# EasyEDA Pro project CH32V003 Programmer.eprj

# Schematic Schematic1
Board Name: Board1; Create Date: 2025-06-25; Page Name: P1; Project Name: CH32V003 Programmer; Schematic Name: Schematic1; Update Date: 2025-08-17; Company: m039; Drawn: Dmitry Mozgin; Page Size: A4; Version: V1.0
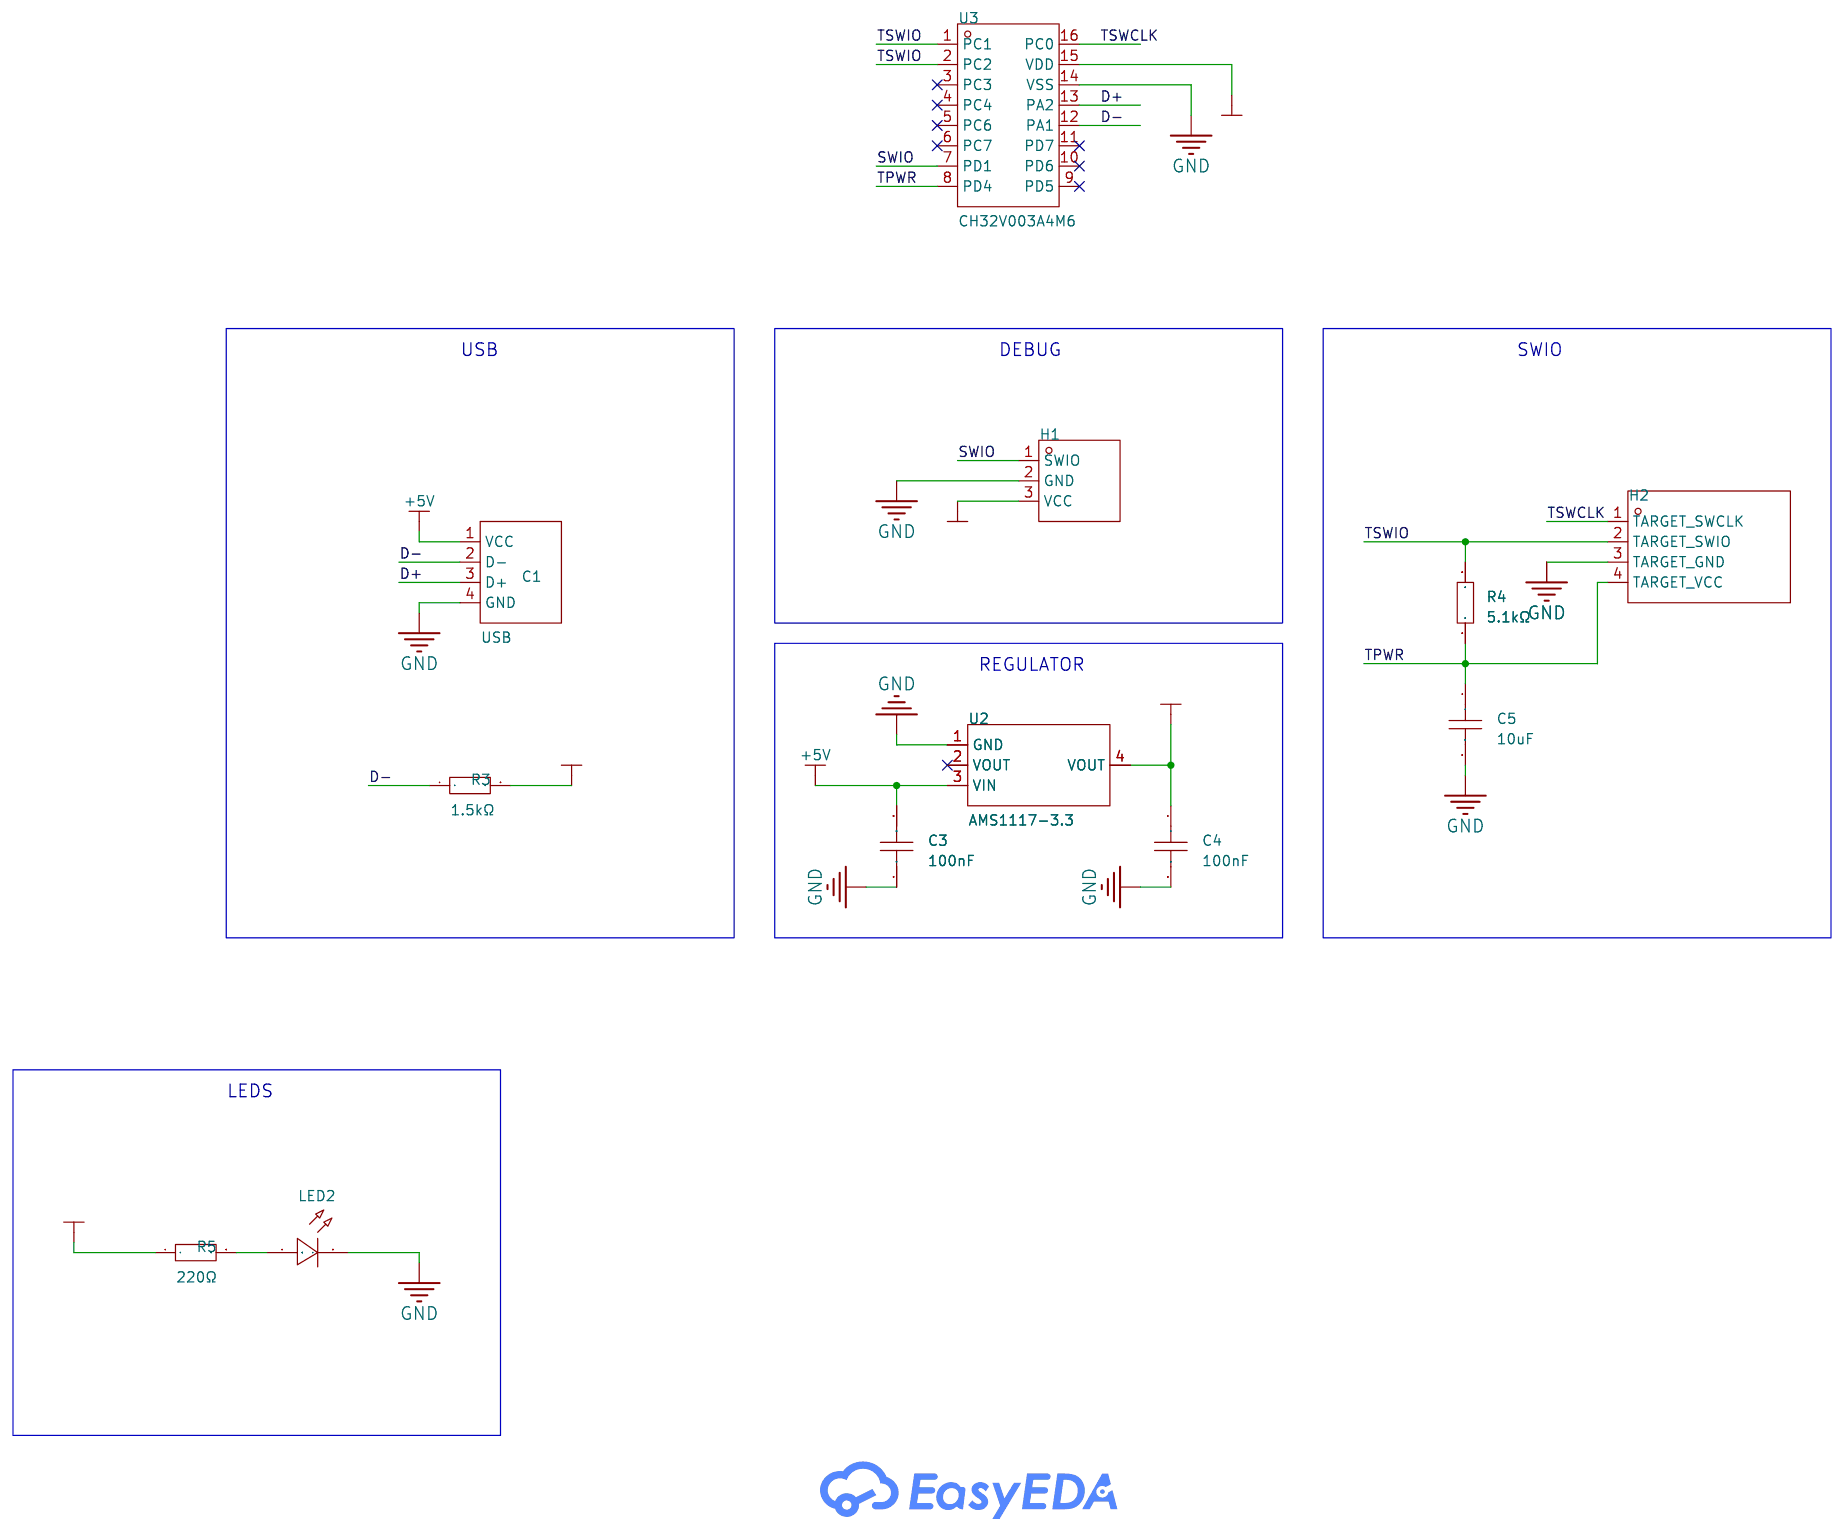
[diagram p0: schematic sheet]

## Parts
C1  USB  [USB Type-C 4P]
C3  100nF  [CAP-TH_L5.8-W3.0-P4.7-D0.45]
C4  100nF  [CAP-TH_L5.8-W3.0-P4.7-D0.45]
C5  10uF  [CAP-TH_L5.8-W3.0-P4.7-D0.45]
H1  -  [HDR-TH_3P-P2.54-V-M]
H2  -  [HDR-TH_4P-P2.54-V-M]
LED2  -  [LED-TH_BD3.0-P2.54-FD]
R3  1.5kΩ  [RES-TH_BD1.8-L3.2-P7.20-D0.4]
R4  5.1kΩ  [RES-TH_BD1.8-L3.2-P7.20-D0.4]
R5  220Ω  [RES-TH_BD1.8-L3.2-P7.20-D0.4]
U2  AMS1117-3.3  [SOT-223-3_L6.5-W3.4-P2.30-LS7.0-BR]
U3  CH32V003A4M6  [SOIC-16_L9.9-W3.9-P1.27-LS6.0-BL]

## Library data of the parts
C1 = USB Type-C 4P Board
C3-C5 = 1C10Z5U104M050B: LCSC Part Name: 100nF ±20% 50V; Supplier Part: C3009699; Manufacturer: VISHAY(威世); Supplier Footprint: 插件,P=10mm; JLCPCB Part Class: Extended Part; Datasheet: https://atta.szlcsc.com/upload/public/pdf/source/20210701/0CF1A7AD3406E72B391D35880AF61B15.pdf; Supplier: LCSC; Tolerance: ±20%; Voltage Rating: 50V; Pin Spacing: 2.54mm; Temperature Coefficient: Z5U; Diameter: 5.08mm; Body Thickness: 3.18mm
H1 = HDR-M_2.54_1x3P: Supplier Footprint: Through
H2 = HDR-M_2.54_1x4P: Supplier Footprint: Through
LED2 = LED_TH-R_3mm: Supplier Footprint: Through
R3-R5 = Res_AXIAL-1/8W: Supplier Footprint: Through
U2 = AMS1117-3.3_C6186: LCSC Part Name: 输出3.3V 1A; Supplier Part: C6186; Manufacturer: AMS; Supplier Footprint: SOT-223; JLCPCB Part Class: Basic Part; Datasheet: https://atta.szlcsc.com/upload/public/pdf/source/20180727/C6186_7A095716F0823C02F1997A905E26C086.pdf; Supplier: LCSC; Output Type: Fixed; Voltage - Supply: 16V; Output Voltage: 3.3V; Output Current: 1A; Power Supply Rejection Ratio (PSRR): 72dB@(120Hz); Voltage Dropout: 1.1V@(800mA); standby current: 5mA; Features: Over Current Protection；Over Temperature Protection; Operating Temperature: -40℃~+125℃; Output Configuration: Positive; Number of Outputs: 1
U3 = CH32V003A4M6: Supplier Part: C5346357; Manufacturer: WCH(南京沁恒); Supplier Footprint: SOP-16; JLCPCB Part Class: Extended Part; Datasheet: https://atta.szlcsc.com/upload/public/pdf/source/20250604/86DFE64B14CD7099775DB96D45CE90A6.pdf; Supplier: LCSC

## Nets
+3.3V: C4.1 H1.3(VCC) R3.2 R5.1 U2.4(VOUT) U3.15(VDD)
+5V: C1.1(VCC) C3.2 U2.3(VIN)
GND: C1.4(GND) C3.1 C4.2 C5.2 H1.2(GND) H2.3(TARGET_GND) LED2.2(A) U2.1(GND) U3.14(VSS)
D+: C1.3(D+) U3.13(PA2)
D-: C1.2(D-) R3.1 U3.12(PA1)
SWIO: H1.1(SWIO) U3.7(PD1)
TPWR: C5.1 H2.4(TARGET_VCC) R4.1 U3.8(PD4)
TSWCLK: H2.1(TARGET_SWCLK) U3.16(PC0)
TSWIO: H2.2(TARGET_SWIO) R4.2 U3.1(PC1) U3.2(PC2)
$1N3644: LED2.1(C) R5.2

Not connected (* = marked no-connect by the designer): U2 2(VOUT)*; U3 3(PC3)* 4(PC4)* 5(PC6)* 6(PC7)* 9(PD5)* 10(PD6)* 11(PD7)*

## Notes on the sheet
- USB
- DEBUG
- SWIO
- REGULATOR
- LEDS

# Board PCB1
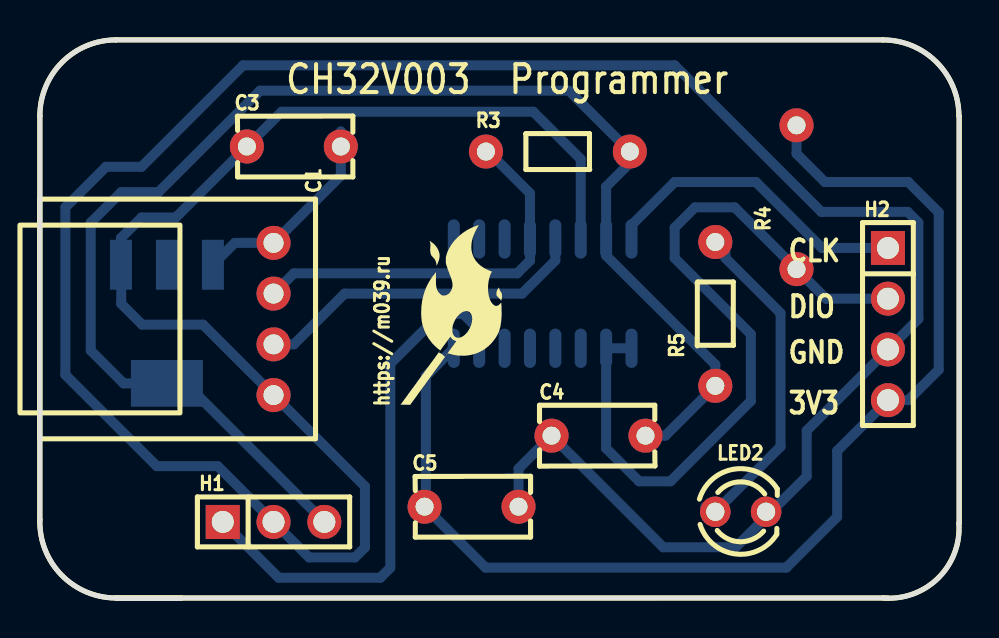
[diagram p1: board, top side]
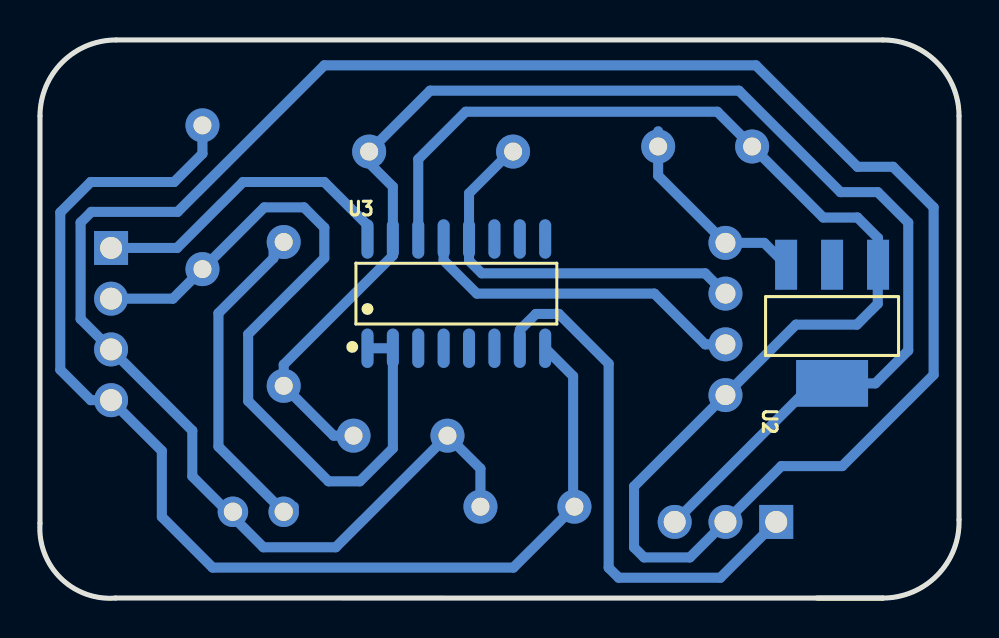
[diagram p2: board, bottom side, seen from below]

Outline 45.97 x 27.94 mm; copper layers: Top Layer, Bottom Layer. Coordinates in mm from the lower left corner of the outline.
Outline path: 3.81,0 arc(1.08,1.15) 0,3.92 0,24.13 arc(1.12,26.83) 3.81,27.94 42.16,27.94 arc(44.86,26.82) 45.97,24.13 45.97,3.74 arc(44.94,1) 42.19,0 3.81,0 ; 3.81,0 7.11,0
Stack: Top Layer 0.035mm / Dielectric1 1.51mm FR4 er 4.5 / Bottom Layer 0.035mm

## Design rules (mm)
template: Custom Config
spacing copperThickness1oz (default): track to track 0.3, other pairs 0.152 to 0.3
spacing copperThickness2oz: track to track 0.203, other pairs 0.152 to 0.3
track width copperThickness1oz (default): min 0.127, default 0.5, max 2.54
track width copperThickness2oz: min 0.203, default 0.254, max 2.54
differential pair differentialPair (default): width min 0.127, default 0.254, max 2.54; gap min 0.152, default 0.152
via viaSize (default): diameter min 0.5, default 0.61, max 10; hole min 0.3, default 0.305, max 6.3

## Placement (name value [footprint] x y rotation side)
C1  USB  [USB Type-C 4P]  11.68 13.97 270 top
C3  100nF  [CAP-TH_L5.8-W3.0-P4.7-D0.45]  12.7 22.61 0 top
C4  100nF  [CAP-TH_L5.8-W3.0-P4.7-D0.45]  27.94 8.13 180 top
C5  10uF  [CAP-TH_L5.8-W3.0-P4.7-D0.45]  21.59 4.57 0 top
H1  -  [HDR-TH_3P-P2.54-V-M]  11.68 3.81 0 top
H2  -  [HDR-TH_4P-P2.54-V-M]  42.42 13.72 270 top
LED2  -  [LED-TH_BD3.0-P2.54-FD]  35.05 4.32 0 top
R3  1.5kΩ  [RES-TH_BD1.8-L3.2-P7.20-D0.4]  25.91 22.35 0 top
R4  5.1kΩ  [RES-TH_BD1.8-L3.2-P7.20-D0.4]  37.85 20.07 270 top
R5  220Ω  [RES-TH_BD1.8-L3.2-P7.20-D0.4]  33.78 14.23 90 top
U2  AMS1117-3.3  [SOT-223-3_L6.5-W3.4-P2.30-LS7.0-BR]  6.35 13.72 90 bottom
U3  CH32V003A4M6  [SOIC-16_L9.9-W3.9-P1.27-LS6.0-BL]  25.15 15.24 180 bottom

## Footprints (pads in the part's own frame, mm; a bottom-side part is the same pattern mirrored in y, then rotated)
CAP-TH_L5.8-W3.0-P4.7-D0.45
  round 1.7 hole 0.9: 1(-2.35,0) 2(2.35,0)
HDR-TH_3P-P2.54-V-M
  rect 1.7x1.7 hole 1.1x0.9: 1(-2.54,0)
  round 1.7 hole 1.1x0.9: 2(0,0) 3(2.54,0)
HDR-TH_4P-P2.54-V-M
  rect 1.7x1.7 hole 1.1x0.9: 1(-3.81,0)
  round 1.7 hole 1.1x0.9: 2(-1.27,0) 3(1.27,0) 4(3.81,0)
LED-TH_BD3.0-P2.54-FD
  round 1.524 hole 0.914x0.9: 1(-1.27,0) 2(1.27,0)
RES-TH_BD1.8-L3.2-P7.20-D0.4
  round 1.7 hole 0.9: 1(-3.6,0) 2(3.6,0)
SOIC-16_L9.9-W3.9-P1.27-LS6.0-BL
  oval 0.602x1.971 smd: 1(-4.445,-2.736) 2(-3.175,-2.736) 3(-1.905,-2.736) 4(-0.635,-2.736) 5(0.635,-2.736) 6(1.905,-2.736) 7(3.175,-2.736) 8(4.445,-2.736) 9(4.445,2.736) 10(3.175,2.736) 11(1.905,2.736) 12(0.635,2.736) 13(-0.635,2.736) 14(-1.905,2.736) 15(-3.175,2.736) 16(-4.445,2.736)
SOT-223-3_L6.5-W3.4-P2.30-LS7.0-BR
  rect 2.5x1.1 smd: 1(2.97,-2.3) 2(2.97,0) 3(2.97,2.3)
  rect 2.34x3.6 smd: 4(-2.97,0)
USB Type-C 4P
  round 1.7 hole 1x0.9: 1(-3.81,0) 2(-1.27,0) 3(1.27,0) 4(3.81,0)

## Nets
As in the schematic.

Pads without a net: U2 2; U3 3 4 5 6 9 10 11

## Routing (per net, layer and track width the routed paths; a pad name or vN(x,y) marks a point on that pad's centre or on a via; arc(x,y) is an arc through that point)
+3.3V: length 71.6
  Bottom Layer w0.5: C4.1 31.29,8.13 R5.1 33.78,11.69 28.32,17.15 U3.15 28.32,20.59 29.51,21.78 R3.2 26.46,25.4 11.01,25.4 5.93,20.32 4.06,20.32 2.54,18.8 2.54,12.39 4.19,10.75 U2.4 7.29,10.75 H1.3
+5V: length 10.5
  Bottom Layer w0.5: U2.3 9.74,17.78 C1.1 15.05,21.15 15.05,23.37
GND: length 164.3
  Bottom Layer w0.5: 26.1,7.62 31.18,2.54 34.8,2.54 38.35,6.1 38.35,8.38 H2.3 43.94,13.97 43.94,18.8 43.41,19.33 39.09,19.33 31.75,26.67 10.16,26.67 5.08,21.59 3.3,21.59 1.27,19.56 1.27,11.18 5.84,6.61 8.89,6.61 H1.2 13.46,2.03 15.76,2.03 16.26,2.53 16.26,5.59 C1.4 8.16,13.69 5.11,13.69 4.06,14.73 4.06,16.67 U2.1 4.05,18.02 5.08,19.05 6.79,19.05 C3.1 12.09,24.35 24.68,24.35 27.05,21.97 U3.14 ; C4.2 23.94,6.48 C5.2
D+: length 16.9
  Bottom Layer w0.5: U3.13 25.78,16.9 24.12,15.24 15.24,15.24 12.7,12.7 C1.3
D-: length 20
  Bottom Layer w0.5: R3.1 22.42,22.35 24.51,20.26 U3.12 24.51,16.89 23.88,16.26 12.7,16.26 C1.2
SWIO: length 26.7
  Bottom Layer w0.5: 21.97,12.51 21.97,13.42 21.16,14.23 20.02,14.23 17.53,11.73 17.53,1.52 17.03,1.02 11.94,1.02 H1.1
TPWR: length 59.2
  Bottom Layer w0.5: R4.1 37.85,22.25 39.26,20.83 43.43,20.83 44.96,19.31 44.96,11.43 43.43,9.91 H2.4 39.88,7.37 39.88,4.07 37.34,1.53 22.29,1.53 C5.1 19.3,4.64 19.3,11.11 U3.8
TSWCLK: length 15.8
  Bottom Layer w0.5: 29.59,17.98 29.59,18.67 31.75,20.83 35.81,20.83 39.12,17.53 H2.1
TSWIO: length 39.1
  Bottom Layer w0.5: H2.2 39.33,14.99 R4.2 34.75,19.56 32.77,19.56 31.75,18.54 31.75,17.02 35.56,13.21 35.56,9.87 31.54,5.84 29.97,5.84 28.32,7.49 U3.2 29.59,12.51
$1N3644: length 16.1
  Bottom Layer w0.5: LED2.1 37.05,7.58 37.05,14.26 34.29,17.02 34.29,17.83 ; 33.27,4.57 33.41,4.57

## Text on the board
Top Silkscreen Layer: https://m039.ru | CLK | DIO | GND | 3V3 | CH32V003 | Programmer
